# EAGLE design seletor (EAGLE 7.6.0)
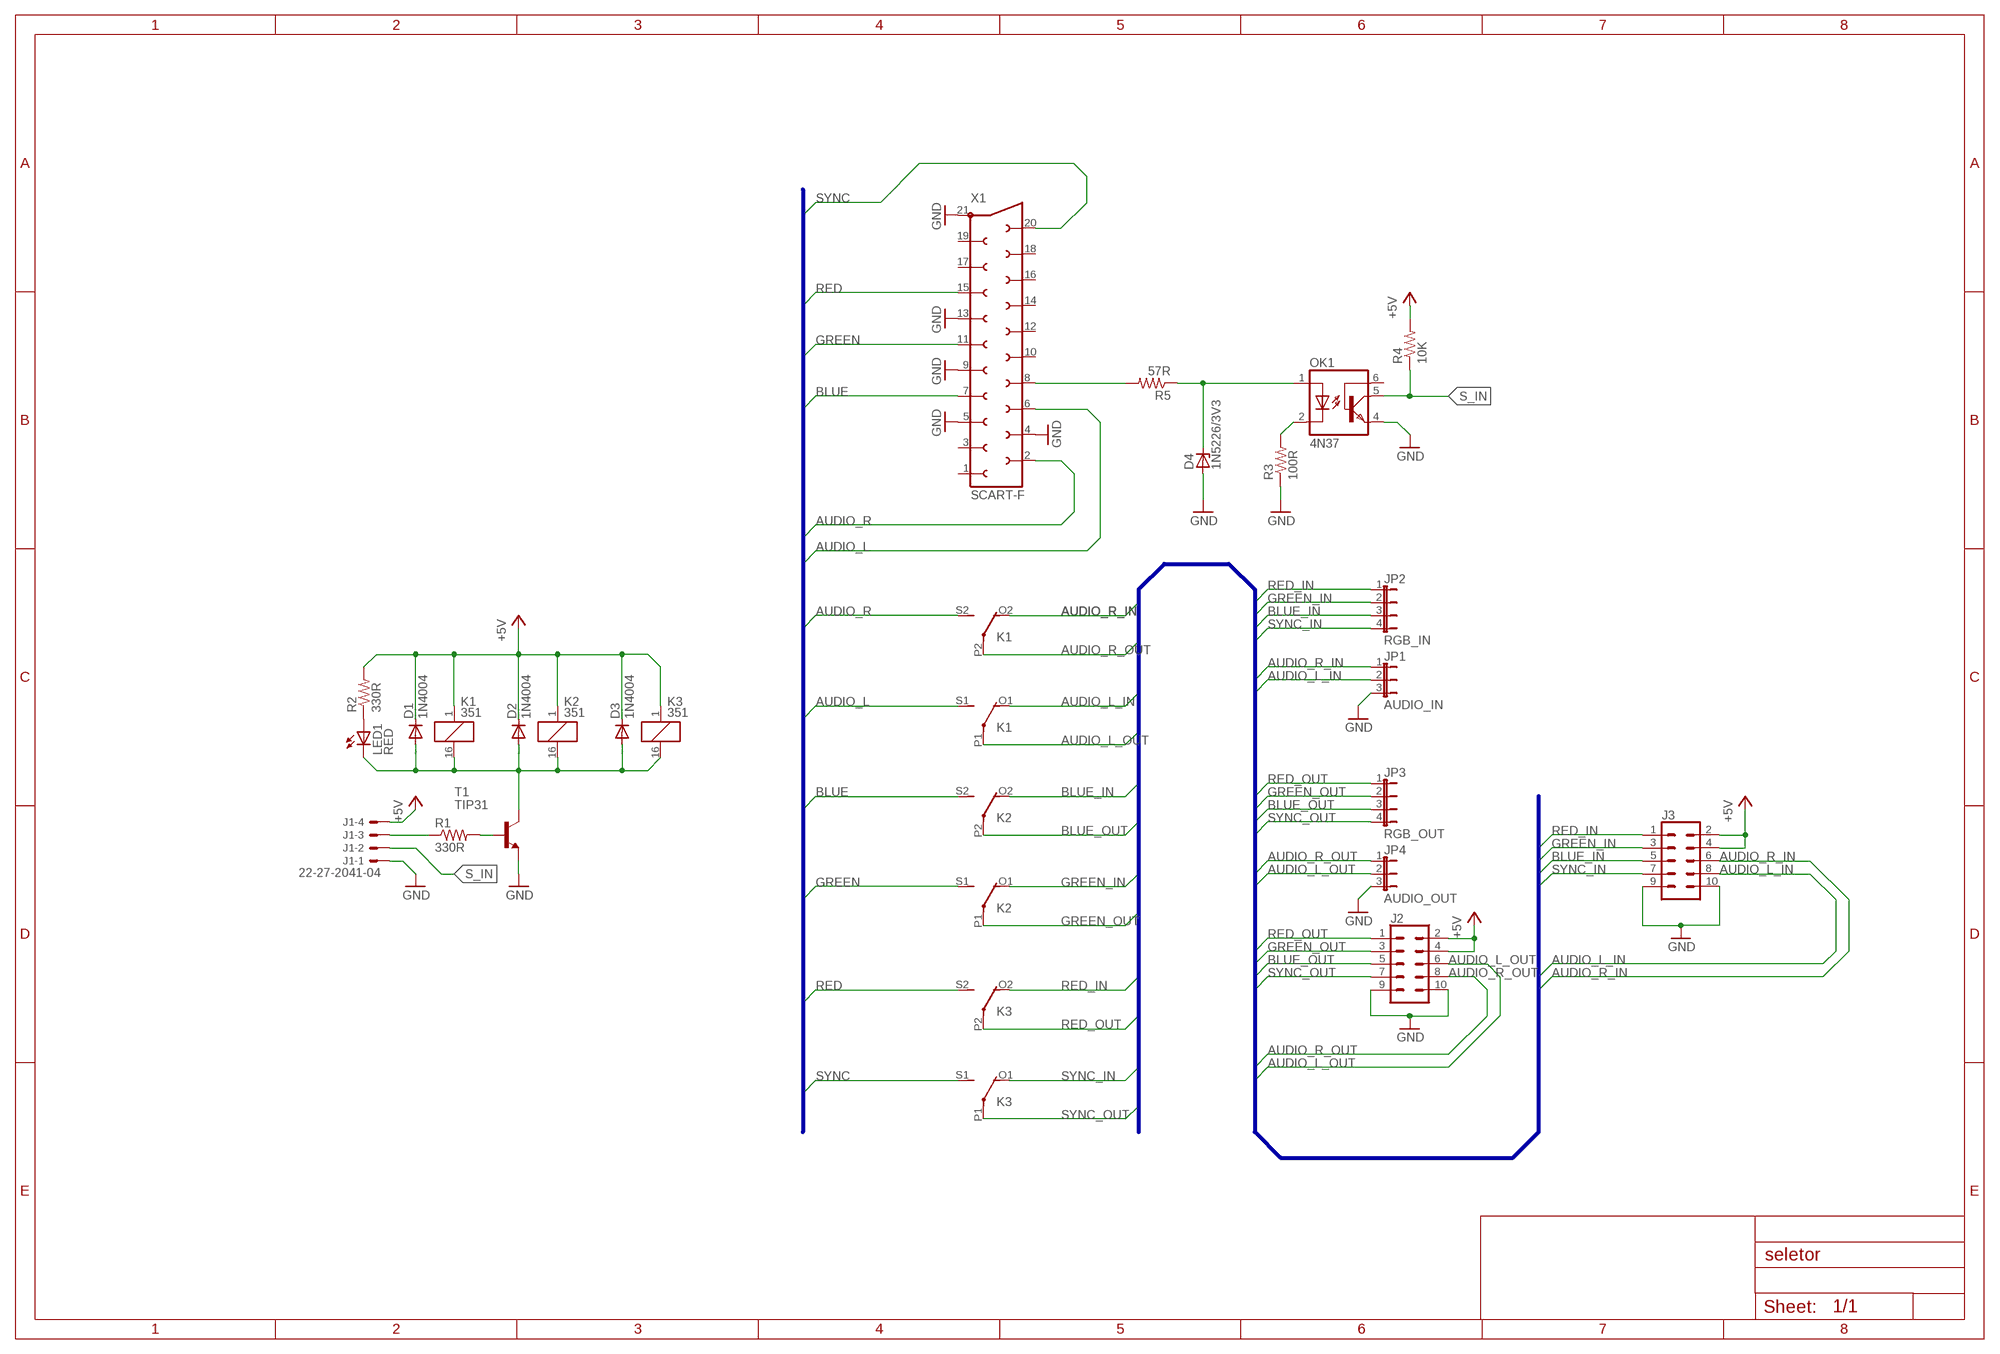
[diagram p0: schematic, sheet 1]

## Parts
D1  1N4004  [DO41-10]
D2  1N4004  [DO41-10]
D3  1N4004  [DO41-10]
D4  1N5226/3V3  BZX90  [DO34Z7]
J1  22-27-2041-04  [6410-04]
J2  CONN_05X2SHD-NS  [2X5-SHROUDED-NS]
J3  CONN_05X2SHD-NS  [2X5-SHROUDED-NS]
JP1  AUDIO_IN  JP2E  [JP2]
JP2  RGB_IN  JP4E  [JP4]
JP3  RGB_OUT  JP4E  [JP4]
JP4  AUDIO_OUT  JP2E  [JP2]
K1  351  [351]
K2  351  [351]
K3  351  [351]
LED1  RED  LED5MM  [LED5MM]
OK1  4N37  [DIL06]
R1  330R  R-US_0204/7  [0204/7]
R2  330R  R-US_0204/7  [0204/7]
R3  100R  R-US_0204/7  [0204/7]
R4  10K  R-US_0204/7  [0204/7]
R5  57R  R-US_0204/7  [0204/7]
T1  TIP31  [TO220]
X1  SCART-F  [SCART-F]

## Nets
+5V [+5V]: D1.C D2.C D3.C J1.4 J2.2 J2.4 J3.2 J3.4 K1.1 K2.1 K3.1 R2.2 R4.2
AUDIO_L [singal]: K1.S1(2:S) X1.6
AUDIO_L_IN [singal]: J3.8 JP1.2 K1.O1(2:O)
AUDIO_L_OUT [singal]: J2.6 JP4.2 K1.P1(2:P)
AUDIO_R [singal]: K1.S2(3:S) X1.2
AUDIO_R_IN [singal]: J3.6 JP1.1 K1.O2(3:O)
AUDIO_R_OUT [singal]: J2.8 JP4.1 K1.P2(3:P)
BLUE [singal]: K2.S2(3:S) X1.7
BLUE_IN [singal]: J3.5 JP2.3 K2.O2(3:O)
BLUE_OUT [singal]: J2.5 JP3.3 K2.P2(3:P)
GND: D4.A J1.1 J2.9 J2.10 J3.9 J3.10 JP1.3 JP4.3 OK1.4(EMI) R3.1 T1.3(E) X1.4 X1.5 X1.9 X1.13 X1.21
GREEN [singal]: K2.S1(2:S) X1.11
GREEN_IN [singal]: J3.3 JP2.2 K2.O1(2:O)
GREEN_OUT [singal]: J2.3 JP3.2 K2.P1(2:P)
N$1: J1.3 R1.1
N$2: D1.A D2.A D3.A K1.16 K2.16 K3.16 LED1.K(C) T1.2(C)
N$3: LED1.A R2.1
N$4: D4.C OK1.1(A) R5.1
N$5: OK1.2(C) R3.2
N$6: R5.2 X1.8
N$7: R1.2 T1.1(B)
RED [singal]: K3.S2(3:S) X1.15
RED_IN [singal]: J3.1 JP2.1 K3.O2(3:O)
RED_OUT [singal]: J2.1 JP3.1 K3.P2(3:P)
S_IN: J1.2 OK1.5(COL) R4.1
SYNC [singal]: K3.S1(2:S) X1.20
SYNC_IN [singal]: J3.7 JP2.4 K3.O1(2:O)
SYNC_OUT [singal]: J2.7 JP3.4 K3.P1(2:P)
Unconnected: OK1.6(BAS) X1.1 X1.3 X1.10 X1.12 X1.14 X1.16 X1.17 X1.18 X1.19

## Buses
B$1
B$2

## Library data of the parts
D1-D3 = diode:1N4004: DIODE general purpose rectifier, 1 A
D4 = diode:BZX90: Z DIODE
J1 = con-molex:22-?-04: CONNECTOR wire to board 2.54 mm (.1 inch) pitch header; OC_FARNELL: unknown; OC_NEWARK: unknown
J2 J3 = SparkFun-Connectors:CONN_05X2: Multi connection point. Often used as Generic Header-pin footprint for 0.1 inch spaced/style header connections For AVR SPI programming port, see special device with nice symbol: "AVR_SPI_PROG_5x2.dev" You can populate with any combo of single row headers, but if you'd like an exact match, check these: 2x5 AVR ICSP Male Header <https://www.sparkfun.com/products/778> (PRT-00778) 2x5 Pin Shrouded Header <https://www.sparkfun.com/products/8506> (PRT-08506) On any of the 0.1 inch spaced packages, you can populate with these: Break Away Headers - Straight <https://www.sparkfun.com/products/116> (PRT-00116) Break Away Male Headers - Right Angle <https://www.sparkfun.com/products/553> (PRT-00553) Female Headers <https://www.sparkfun.com/products/115> (PRT-00115) Break Away Headers - Machine Pin <https://www.sparkfun.com/products/117> (PRT-00117) Break Away Female Headers - Swiss Machine Pin <https://www.sparkfun.com/products/743> (PRT-00743) Special note: the shrouded connector mates well with our 5x2 ribbon cables: 2x5 Pin IDC Ribbon Cable <https://www.sparkfun.com/products/8535> (PRT-08535); PROD_ID: CONN-08671; SF_ID: PRT-08506
JP1 JP4 = jumper:JP2E: JUMPER
JP2 JP3 = jumper:JP4E: JUMPER
K1-K3 = relay:351: RELAY 2 x switch, Omron; OC_FARNELL: unknown; OC_NEWARK: unknown
LED1 = led:LED: LED OSRAM: - CHIPLED LG R971, LG N971, LY N971, LG Q971, LY Q971, LO R971, LY R971 LH N974, LH R974 LS Q976, LO Q976, LY Q976 LO Q996 - Hyper CHIPLED LW Q18S LB Q993, LB Q99A, LB R99A - SideLED LS A670, LO A670, LY A670, LG A670, LP A670 LB A673, LV A673, LT A673, LW A673 LH A674 LY A675 LS A676, LA A676, LO A676, LY A676, LW A676 LS A679, LY A679, LG A679 - Hyper Micro SIDELED® LS Y876, LA Y876, LO Y876, LY Y876 LT Y87S - SmartLED LW L88C, LW L88S LB L89C, LB L89S, LG L890 LS L89K, LO L89K, LY L89K LS L896, LA L896, LO L896, LY L896 - TOPLED LS T670, LO T670, LY T670, LG T670, LP T670 LSG T670, LSP T670, LSY T670, LOP T670, LYG T670 LG T671, LOG T671, LSG T671 LB T673, LV T673, LT T673, LW T673 LH T674 LS T676, LA T676, LO T676, LY T676, LB T676, LH T676, LSB T676, LW T676 LB T67C, LV T67C, LT T67C, LS T67K, LO T67K, LY T67K, LW E67C LS E67B, LA E67B, LO E67B, LY E67B, LB E67C, LV E67C, LT E67C LW T67C LS T679, LY T679, LG T679 LS T770, LO T770, LY T770, LG T770, LP T770 LB T773, LV T773, LT T773, LW T773 LH T774 LS E675, LA E675, LY E675, LS T675 LS T776, LA T776, LO T776, LY T776, LB T776 LHGB T686 LT T68C, LB T68C - Hyper Mini TOPLED® LB M676 - Mini TOPLED Santana® LG M470 LS M47K, LO M47K, LY M47K Source: http://www.osram.convergy.de LUXEON: - LUMILED® LXK2-PW12-R00, LXK2-PW12-S00, LXK2-PW14-U00, LXK2-PW14-V00 LXK2-PM12-R00, LXK2-PM12-S00, LXK2-PM14-U00 LXK2-PE12-Q00, LXK2-PE12-R00, LXK2-PE12-S00, LXK2-PE14-T00, LXK2-PE14-U00 LXK2-PB12-K00, LXK2-PB12-L00, LXK2-PB12-M00, LXK2-PB14-N00, LXK2-PB14-P00, LXK2-PB14-Q00 LXK2-PR12-L00, LXK2-PR12-M00, LXK2-PR14-Q00, LXK2-PR14-R00 LXK2-PD12-Q00, LXK2-PD12-R00, LXK2-PD12-S00 LXK2-PH12-R00, LXK2-PH12-S00 LXK2-PL12-P00, LXK2-PL12-Q00, LXK2-PL12-R00 Source: www.luxeon.com KINGBRIGHT: KA-3528ASYC Source: www.kingbright.com
OK1 = optocoupler:4N37: OPTO COUPLER Source: http://www.fairchildsemi.com/pf/4N/4N35-M.html; MF: FAIRCHILD SEMICONDUCTOR; MPN: 4N37; OC_FARNELL: 1612456; OC_NEWARK: 72K9948
R1 R2 R5 = rcl:R-US_: RESISTOR, American symbol
R3 R4 = resistor:R-US_: RESISTOR, American symbol
T1 = transistor:TIP31: NPN Transistor Medium Power Linear Switching Applications Source: http://onsemi.com
X1 = con-hirschmann:SCART-F: TV SCART CONNECTOR; OC_FARNELL: unknown; OC_NEWARK: unknown

## Net classes
0 default: width 0.406 mm
1 singal: width 0.5 mm
2 +5V: width 0.5 mm

## Board
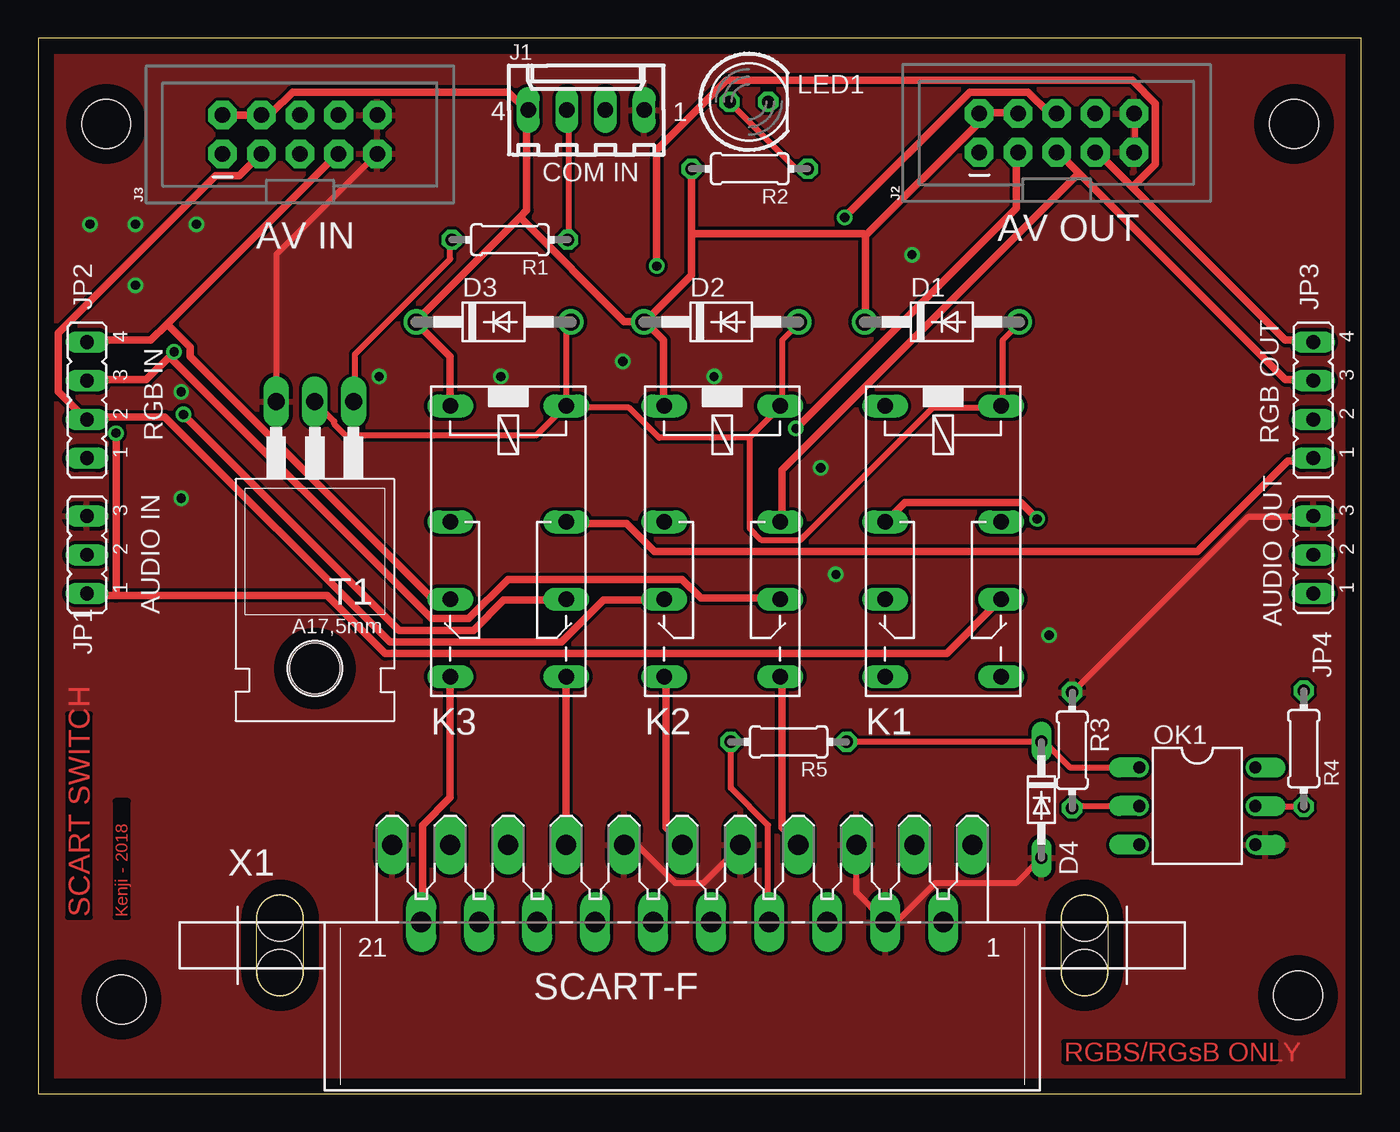
[diagram p1: board, top side]
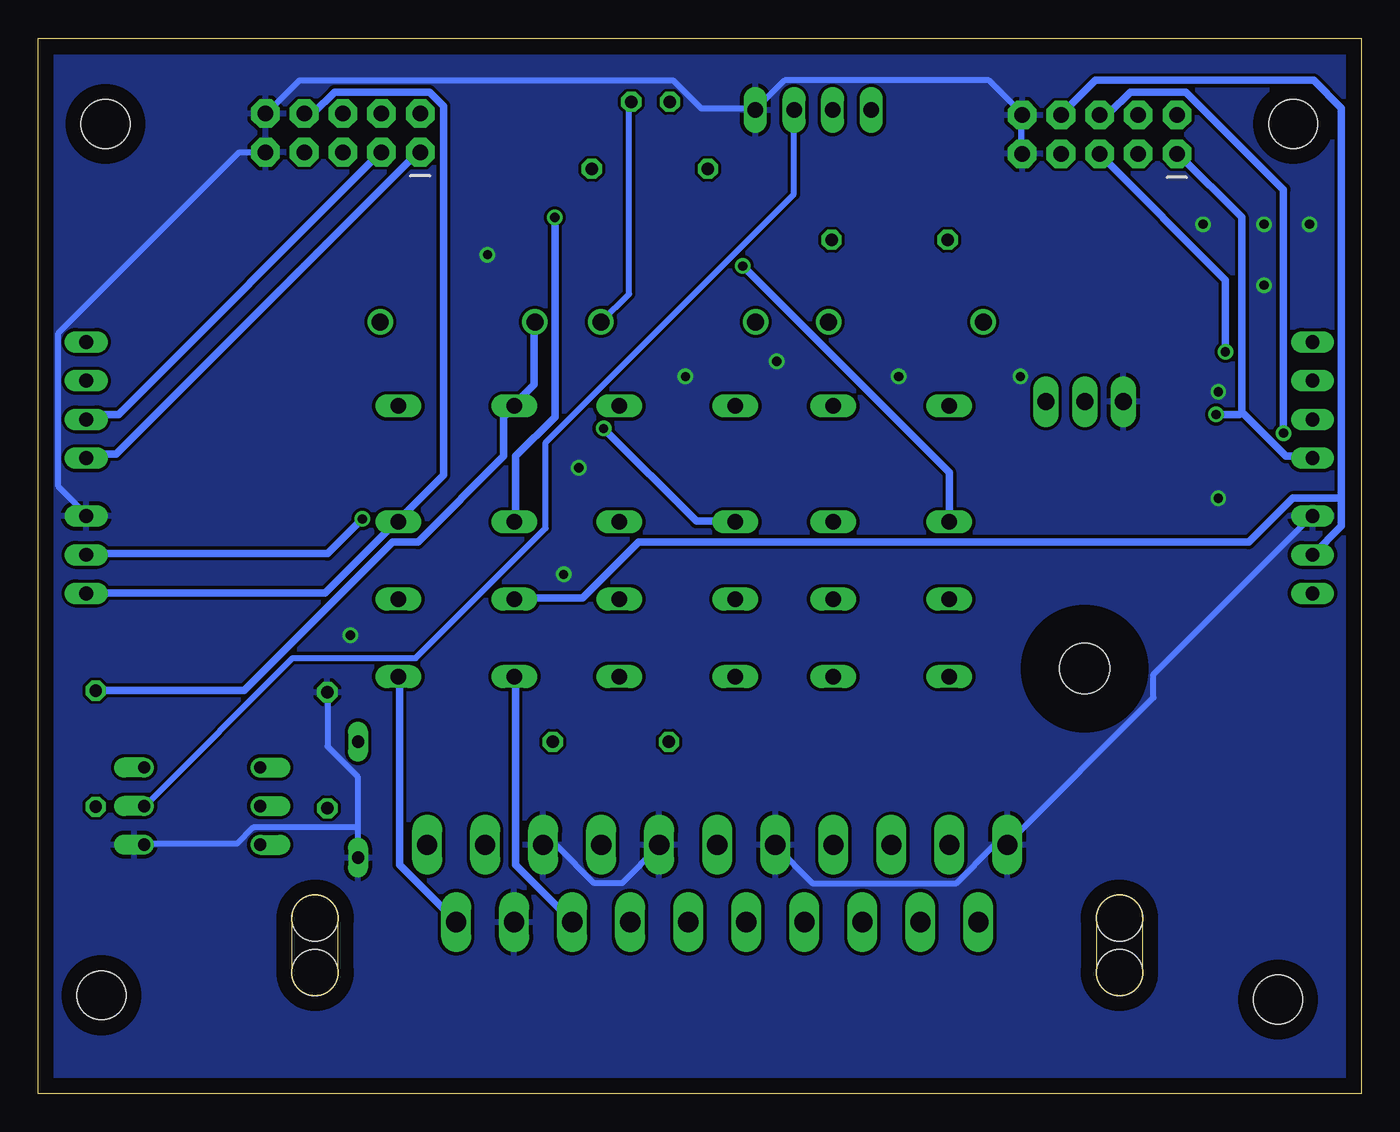
[diagram p2: board, bottom side, seen from below]

Size 86.92 x 69.33 mm. Coordinates in mm from the lower left corner, seen from the top.
Outline: 0,0 86.92,0 86.92,69.33 0,69.33 0,0
Copper layers (1*16): Top 0.035mm / dielectric 1.5mm / Bottom 0.035mm
Design rules "default": minimum track width 10mil, minimum drill 24mil, track to track 8mil, track to pad 8mil, pad to pad 8mil, via to via 8mil, smd to smd 8mil, copper to edge 40mil, drill to drill 8mil, minimum pad ring 10mil, minimum via ring 8mil, stop-mask expansion 4mil, vias tented up to drill 0mil, thermal gap 10mil
Holes 3.2 mm at 5.48,6.18 82.76,6.45 4.48,63.68 82.49,63.68

### Footprints (pad centres in the part's own frame; a part is rotated, then mirrored left to right if it is on the bottom)
DO41-10 = drill 1.118: A 5.08,0; C -5.08,0
DO34Z7 = drill 0.813 long: A 3.81,0; C -3.81,0
6410-04 = drill 1.016 long: 1 3.81,0; 2 1.27,0; 3 -1.27,0; 4 -3.81,0
2X5-SHROUDED-NS = drill 1.016 pad 1.88 octagon: 1 -1.27,5.08; 2 1.27,5.08; 3 -1.27,2.54; 4 1.27,2.54; 5 -1.27,0; 6 1.27,0; 7 -1.27,-2.54; 8 1.27,-2.54; 9 -1.27,-5.08; 10 1.27,-5.08
JP2 = drill 0.914 long: 1 -2.54,0; 2 0,0; 3 2.54,0
JP4 = drill 0.914 long: 1 -3.81,0; 2 -1.27,0; 3 1.27,0; 4 3.81,0
351 = drill 1.016 long: 1 -3.81,-3.81; 16 -3.81,3.81; O1 8.89,-3.81; O2 8.89,3.81; P1 3.81,-3.81; P2 3.81,3.81; S1 13.97,-3.81; S2 13.97,3.81
LED5MM = drill 0.813 octagon: A -1.27,0; K 1.27,0
DIL06 = drill 0.813 offset: 1 -2.54,-3.81; 2 0,-3.81; 3 2.54,-3.81; 4 2.54,3.81; 5 0,3.81; 6 -2.54,3.81
0204/7 = drill 0.813 octagon: 1 -3.81,0; 2 3.81,0
TO220 = drill 1.118 long: 1 -2.54,-6.35; 2 0,-6.35; 3 2.54,-6.35 | hole 3.302: 0,11.176
SCART-F = drill 1.321 long: 1 19.05,5.08; 2 17.145,0; 3 15.24,5.08; 4 13.335,0; 5 11.43,5.08; 6 9.525,0; 7 7.62,5.08; 8 5.715,0; 9 3.81,5.08; 10 1.905,0; 11 0,5.08; 12 -1.905,0; 13 -3.81,5.08; 14 -5.715,0; 15 -7.62,5.08; 16 -9.525,0; 17 -11.43,5.08; 18 -13.335,0; 19 -15.24,5.08; 20 -17.145,0; 21 -19.05,5.08 | hole 3.023: 26.416,0.254; 26.416,-3.302; -26.416,0.254; -26.416,-3.302

### Placement (x,y rotation side)
D1  59.36,50.68 0 top
D2  44.87,50.68 0 top
D3  29.92,50.68 0 top
D4  65.9,19.3 270 top
J1  36,64.6 0 top
J2  66.9,63.1 90 top
J3  17.2,63 90 top
JP1  3.21,35.39 90 top
JP2  3.21,45.55 90 top
JP3  83.76,45.55 90 top
JP4  83.76,35.39 90 top
K1  59.44,41.36 270 top
K2  44.93,41.36 270 top
K3  30.88,41.36 270 top
LED1  46.69,65.14 0 top
OK1  76.14,18.88 270 top
R1  30.99,56.08 180 top
R2  46.74,60.74 180 top
R3  67.92,22.55 270 top
R4  83.13,22.65 90 top
R5  49.3,23.1 180 top
T1  18.18,39.09 180 top
X1  42.31,11.26 0 top

### Tracks (layer width: path | path; a pad name or v marks a point on that pad's centre or on a via)
+5V
  Top 0.5: J3.2 12.13,64.26 14.57,64.26 J3.4 14.88,64.41 15.34,64.41 16.71,65.78 30.88,65.78 31.95,64.72 J1.4 32.1,64.56 32.1,58.01 31.64,57.55 | K3.1 27.07,48.41 24.94,50.54 D3.C 24.94,50.85 31.64,57.55 | 42.92,56.49 42.92,53.75 39.87,50.7 D2.C | 42.92,56.49 42.92,60.6 R2.2 | K2.1 41.09,45.21 41.09,49.48 40.02,50.54 D2.C | J2.4 64.26,64.41 61.97,64.41 J2.2 61.66,64.26 61.66,63.65 54.35,56.34 | 54.35,56.34 54.35,50.7 D1.C | 42.92,56.49 54.2,56.49 54.35,56.34 | 31.64,57.55 38.5,50.7 39.57,50.7 D2.C
  Bottom 0.5: R4.2 83,26.46 73.4,26.46 63.65,36.22 61.97,36.22 56.33,41.86 56.33,44.45 55.72,45.06 K1.1 55.57,45.36 54.35,46.58 54.35,50.54 D1.C
AUDIO_L
  Bottom 0.5: K1.S1 55.57,27.38 55.57,15.04 51.91,11.38 X1.6
AUDIO_L_IN
  Bottom 0.5: JP1.2 1.31,37.29 1.31,39.11 | 1.31,39.11 1.31,64.72 3.14,66.55 17.47,66.55 19.6,64.41 J3.8 | 1.31,39.11 4.52,39.11 7.41,36.22 47.49,36.22 51.15,32.56 55.57,32.56 K1.O1
AUDIO_L_OUT  (via drill 0.61)
  Top 0.5: v65.63,37.74 64.56,38.81 56.94,38.81 55.72,37.59 K1.P1 | v52.98,57.55 61.21,65.78 65.02,65.78 66.39,64.41 66.85,64.41 J2.6
  Bottom 0.5: JP4.2 83.61,35.46 67.91,35.46 v65.63,37.74 | v52.98,57.55 52.98,44.45 55.57,41.86 55.57,37.59 K1.P1
AUDIO_R
  Bottom 0.5: K1.S2 63.19,27.38 63.19,15.04 59.53,11.38 X1.2
AUDIO_R_IN  (via drill 0.61)
  Top 0.5: 5.12,32.71 18.99,32.71 22.8,28.9 59.68,28.9 K1.O2 | 5.12,32.71 3.3,32.71 JP1.1 | 5.12,32.71 v5.12,43.38
  Bottom 0.5: v5.12,43.38 5.12,59.38 11.53,65.78 15.18,65.78 16.55,64.41 17.16,64.41 J3.6
AUDIO_R_OUT
  Top 0.5: JP4.1
  Bottom 0.5: JP4.1 83.61,32.87 68.07,32.87 63.34,37.59 K1.P2 63.19,37.74 60.29,40.64 60.29,64.87 61.21,65.78 67.46,65.78 68.83,64.41 69.44,64.41 J2.8
BLUE
  Top 0.5: K2.S2 48.86,27.38 48.86,17.47 49.93,16.41 X1.7
BLUE_IN  (via drill 0.61)
  Top 0.5: JP2.3 3.3,46.89 7.11,46.89 v8.93,48.72 8.78,48.26 25.85,31.19 28.29,31.19 30.88,33.78 42.31,33.78 43.53,32.56 48.71,32.56 K2.O2
  Bottom 0.5: v8.93,48.72 8.93,53.44 17.16,61.67 J3.5
BLUE_OUT
  Top 0.5: 68.37,60.45 67,61.82 J2.5 | 68.37,60.45 81.93,46.89 83.61,46.89 JP3.3 | 68.37,60.45 48.86,40.94 48.86,37.59 K2.P2
GND  (via drill 0.61)
  Top 0.406: T1.3 15.64,55.12 22.19,61.67 J3.9 | X1.5 53.74,13.21 55.57,11.38 X1.4 55.72,11.38 56.48,11.38 58.92,13.82 64.26,13.82 65.78,15.34 D4.A | X1.13 38.5,16.25 39.41,16.25 41.85,13.82 43.68,13.82 46.12,16.25 X1.9 | J2.9 72.03,61.97 72.03,64.26 J2.10 | JP4.3 83.61,37.9 79.5,37.9 68.07,26.46 R3.1
  Bottom 0.406: J3.9 22.35,61.82 22.35,64.11 J3.10 22.35,64.41 24.48,66.55 37.89,66.55 39.72,64.72 J1.1 39.87,64.72 43.38,64.72 45.21,66.55 69.74,66.55 71.88,64.41 J2.10 | JP1.3 3.3,37.9 13.66,27.53 13.66,26.01 23.26,16.41 X1.21 23.41,16.25 24.17,16.25 26.61,13.82 36.06,13.82 38.5,16.25 X1.13 | X1.5 53.74,16.25 52.83,16.25 50.39,13.82 48.56,13.82 46.12,16.25 X1.9 | 65.93,17.47 65.93,20.83 67.91,22.81 67.91,26.31 R3.1 | 65.93,17.47 65.93,15.49 D4.A | 65.93,17.47 72.79,17.47 73.86,16.41 79.8,16.41 OK1.4 | J2.9 72.03,61.82 73.7,61.82 85.59,49.94 85.59,39.88 83.76,38.05 JP4.3
  other vias: 10.4,57.1 6.4,53.1 9.4,39.1 6.4,57.1 3.4,57.1 22.4,47.1 30.4,47.1 38.4,48.1 44.4,47.1 52.4,34.1 51.4,41.1 66.4,30.1 57.4,55.1 9.4,46.1
  pour Bottom: 0.4,68.1 86.4,68.1 86.4,1.1 0.4,1.1
  pour Top: 0.4,68.1 86.4,68.1 86.4,1.1 0.4,1.1
GREEN
  Top 0.5: K2.S1 41.24,27.38 41.24,17.47 42.31,16.41 X1.11
GREEN_IN
  Top 0.5: J3.3 14.57,61.67 13.2,60.3 11.68,60.3 1.31,49.94 1.31,46.12 3.14,44.3 JP2.2 3.3,44.45 8.32,44.45 23.11,29.67 34.38,29.67 37.13,32.41 41.09,32.41 K2.O1
GREEN_OUT  (via drill 0.61)
  Top 0.5: v49.78,43.69 64.26,58.16 64.26,61.82 J2.3
  Bottom 0.5: 83.76,44.23 JP3.2 | 83.31,44.45 83.61,44.45 JP3.2 | JP3.2 83.15,44.6 81.63,44.6 64.41,61.82 J2.3 | v49.78,43.69 43.68,37.59 41.24,37.59 K2.P1
N$1
  Top 0.406: R1.1 34.84,56.18 34.84,64.56 J1.3
N$2
  Top 0.406: K3.16 34.69,50.24 34.99,50.54 D3.A | T1.2 18.23,45.36 19.45,44.14 19.45,43.99 20.21,43.23 32.71,43.23 34.54,45.06 K3.16 | D1.A 64.41,50.54 63.34,49.48 63.34,45.21 K1.16 63.19,45.06 58.77,45.06 50.08,36.37 47.49,36.37 46.73,37.13 46.73,43.08 | D2.A 49.93,50.54 48.86,49.48 48.86,45.21 K2.16 48.71,45.06 46.73,43.08 | 46.73,43.08 40.79,43.08 38.8,45.06 34.84,45.06 K3.16
  Bottom 0.406: LED1.K 48.1,65.02 48.1,52.53 49.93,50.7 D2.A
N$3
  Top 0.406: R2.1 50.54,60.76 49.78,60.76 45.51,65.02 LED1.A
N$4
  Top 0.406: R5.1 53.13,23.11 65.78,23.11 D4.C 66.08,23.11 67.76,21.44 72.18,21.44 OK1.1
N$5
  Top 0.406: R3.2 68.07,18.85 72.18,18.85 OK1.2
N$6
  Top 0.406: R5.2 45.51,22.96 45.51,20.06 47.95,17.63 47.95,11.38 X1.8
N$7
  Top 0.406: R1.2 27.07,56.03 27.07,54.81 20.82,48.56 20.82,45.52 T1.1
RED
  Top 0.5: X1.15 K3.S2
RED_IN  (via drill 0.61)
  Top 0.5: v9.54,44.6 23.72,30.43 28.59,30.43 30.57,32.41 34.69,32.41 K3.O2
  Bottom 0.5: 7.87,44.75 4.97,41.86 3.3,41.86 JP2.1 | 7.87,44.75 7.87,57.55 11.98,61.67 J3.1 | v9.54,44.6 8.02,44.6 7.87,44.75
RED_OUT
  Top 0.5: 83.76,41.69 JP3.1 83.61,41.55 82.09,41.55 76.14,35.61 40.48,35.61 38.65,37.44 34.69,37.44 K3.P2
  Bottom 0.5: 83.61,41.86 JP3.1 83.46,42.01 81.78,42.01 61.97,61.82 J2.1
S_IN
  Top 0.406: R4.1 83,18.85 79.95,18.85 OK1.5
  Bottom 0.406: J1.2 37.28,64.56 37.28,59.08 53.59,42.77 53.59,37.13 62.12,28.6 70.2,28.6 79.8,19 OK1.5
SYNC
  Top 0.5: K3.S1 27.07,19.46 25.24,17.63 25.24,11.38 X1.20
SYNC_IN
  Top 0.5: 8.48,50.54 19.6,61.67 J3.7 | 8.48,50.54 7.41,49.48 3.3,49.48 JP2.4 | 8.48,50.54 10,49.02 10,48.41 25.85,32.56 27.07,32.56 K3.O1
SYNC_OUT  (via drill 0.61)
  Top 0.5: 71.88,59.54 69.59,61.82 J2.7 | 71.88,59.54 81.93,49.48 83.61,49.48 JP3.4 | v40.63,54.35 40.63,61.97 45.21,66.55 71.88,66.55 73.4,65.02 73.4,61.06 71.88,59.54
  Bottom 0.5: 83.76,49.31 JP3.4 | K3.P1 27.07,40.79 v40.63,54.35

### Text on the board
Top: SCART SWITCH | Kenji - 2018 | RGBS/RGsB ONLY
tPlace: COM IN | AV OUT | AV IN | RGB IN | RGB OUT | AUDIO IN | AUDIO OUT